# Altium schematic sheet PAM_Interface.SchDoc
size A3; SheetNumber: 1; SheetTotal: 1
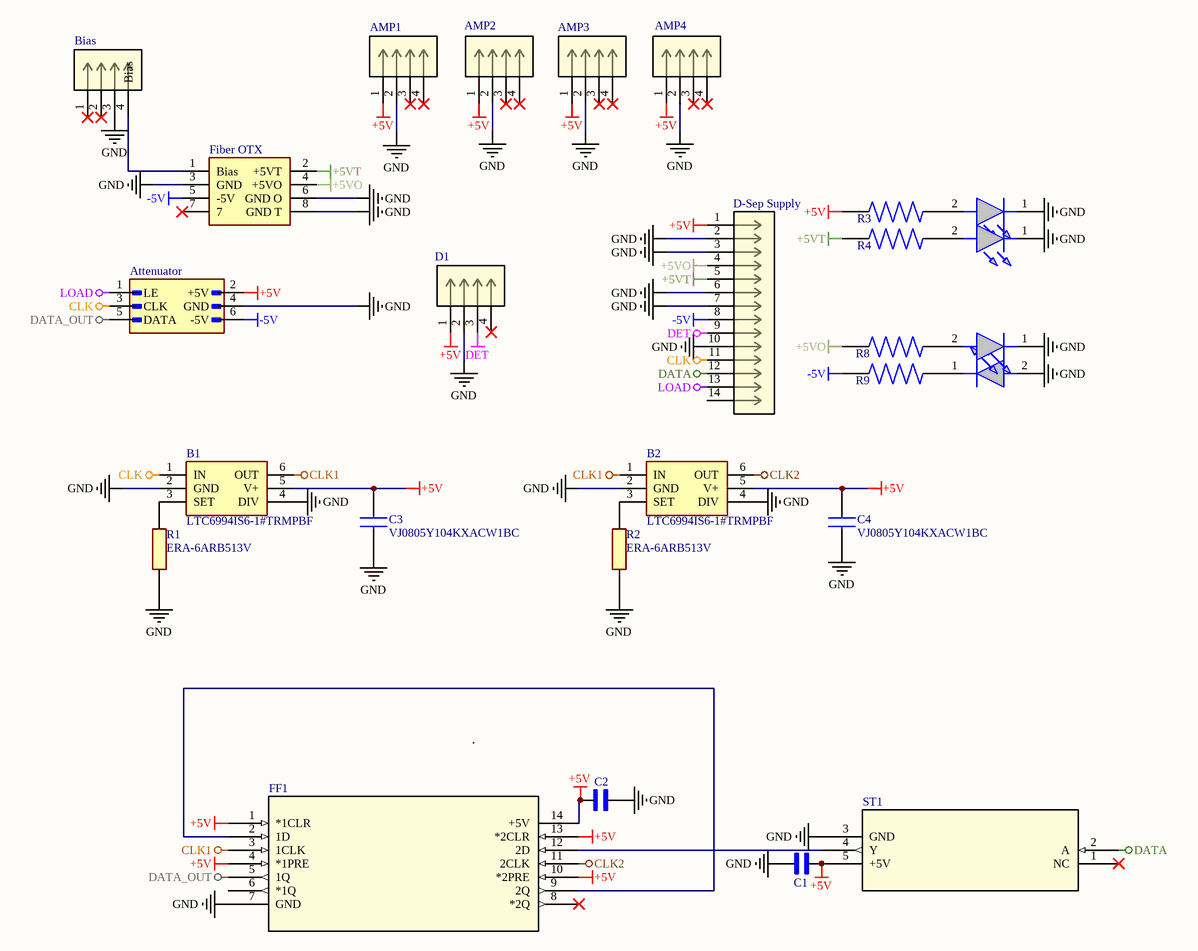
[diagram p0: PAM_Interface.SchDoc]

## Parts
+5VO  SML-LX1206GW-TR  [LEDC3216X110N]  (value not drawn)
+5VT  SML-LX1206GW-TR  [LEDC3216X110N]  (value not drawn)
-5V  SML-LX1206GW-TR  [LEDC3216X110N]  (value not drawn)
AMP1  DF11-4DP-2DSA(24)  [CON4_2X2_UF_DF11_HIR]  (value not drawn)
AMP2  DF11-4DP-2DSA(24)  [CON4_2X2_UF_DF11_HIR]  (value not drawn)
AMP3  DF11-4DP-2DSA(24)  [CON4_2X2_UF_DF11_HIR]  (value not drawn)
AMP4  DF11-4DP-2DSA(24)  [CON4_2X2_UF_DF11_HIR]  (value not drawn)
Attenuator  DF11-6DP-2DSA(24)  [HIROSE_DF11-6DP-2DSA(24)]  (value not drawn)
B1  LTC6994IS6-1#TRMPBF  [SOT95P280X100-6N]
B2  LTC6994IS6-1#TRMPBF  [SOT95P280X100-6N]
Bias  DF11-4DP-2DSA(24)  [CON4_2X2_UF_DF11_HIR]  (value not drawn)
C1  VJ0805Y104KXQCW1BC  [CAPC2012X145N]  (value not drawn)
C2  VJ0805Y104KXQCW1BC  [CAPC2012X145N]  (value not drawn)
C3  VJ0805Y104KXACW1BC  [CAPC2012X70N]
C4  VJ0805Y104KXACW1BC  [CAPC2012X70N]
D1  DF11-4DP-2DSA(24)  [CON4_2X2_UF_DF11_HIR]  (value not drawn)
D-Sep_Supply  DF11-14DP-2DSA(24)  [CON14_2X7_UF_DF11_HIR]  (value not drawn)
FF1  SN74ACT74PWRQ1  [PW14]  (value not drawn)
Fiber_OTX  DF11-8DP-2DSA(24)  [HIROSE_DF11-8DP-2DSA(24)]  (value not drawn)
LED1  SML-LX1206GW-TR  [LEDC3216X110N]  (value not drawn)
R1  ERA-6ARB513V  [ERA6AEB101V]
R2  ERA-6ARB513V  [ERA6AEB101V]
R3  ERA6VEB1000V  [RES_ERA6VEB1000V]  (value not drawn)
R4  ERA6VEB1000V  [RES_ERA6VEB1000V]  (value not drawn)
R8  ERA6VEB1000V  [RES_ERA6VEB1000V]  (value not drawn)
R9  ERA6VEB1000V  [RES_ERA6VEB1000V]  (value not drawn)
ST1  SN74LVC1G17DBVR  [DBV5]  (value not drawn)

## Nets
+5V: AMP1.1(+5V) AMP2.1(+5V) AMP3.1(+5V) AMP4.1(+5V) Attenuator.2(+5V) B1.5(V+) B2.5(V+) C1.2 C2.1 C3.2 C4.2 D1.1(+5V) D-Sep_Supply.1(+5V) FF1.1(*1CLR) FF1.4(*1PRE) FF1.10(*2PRE) FF1.13(*2CLR) FF1.14(+5V) R3.1 ST1.5(+5V)
+5VO: D-Sep_Supply.4(GND) Fiber_OTX.4(+5VO) R8.1
+5VT: D-Sep_Supply.5(DET) Fiber_OTX.2(+5VT) R4.2
-5V: Attenuator.6(-5V) D-Sep_Supply.8(NC) Fiber_OTX.5(-5V) R9.1
CLK: Attenuator.3(CLK) B1.1(IN) D-Sep_Supply.11(GND)
CLK1: B1.6(OUT) B2.1(IN) FF1.3(1CLK)
CLK2: B2.6(OUT) FF1.11(2CLK)
DATA: D-Sep_Supply.12(-5V) ST1.2(A)
DATA_OUT: Attenuator.5(DATA) FF1.5(1Q)
DET: D1.3(DET) D-Sep_Supply.9(GND)
GND: +5VO.1(K) +5VT.1(K) -5V.2(A) AMP1.2(GND) AMP2.2(GND) AMP3.2(GND) AMP4.2(GND) Attenuator.4(GND) B1.2(GND) B1.4(DIV) B2.2(GND) B2.4(DIV) Bias.3(GND) C1.1 C2.2 D1.2(GND) D-Sep_Supply.2(GND) D-Sep_Supply.3(+5V_TEC) D-Sep_Supply.6(CLK) D-Sep_Supply.7(LOAD) D-Sep_Supply.10(+5V_OTX) FF1.7(GND) Fiber_OTX.3(GND) Fiber_OTX.6(GND_O) Fiber_OTX.8(GND_T) LED1.1(K) R1.2 R2.2 ST1.3(GND)
LOAD: Attenuator.1(LE) D-Sep_Supply.13(GND)
Net+5VO_2: +5VO.2(A) R8.2
Net+5VT_2: +5VT.2(A) R4.1
Net-5V_1: -5V.1(K) R9.2
NetB1_3: B1.3(SET) R1.1
NetB2_3: B2.3(SET) R2.1
NetBias_4: Bias.4(Bias) Fiber_OTX.1(Bias)
NetFF1_2: FF1.2(1D) FF1.9(2Q)
NetFF1_12: FF1.12(2D) ST1.4(Y)
NetLED1_2: LED1.2(A) R3.2

Not connected (* = marked no-connect by the designer): AMP1 3* 4*; AMP2 3* 4*; AMP3 3* 4*; AMP4 3* 4*; Bias 1* 2*; C3 1; C4 1; D1 4*; D-Sep_Supply 14(DATA); FF1 6(*1Q) 8(*2Q)*; Fiber_OTX 7*; ST1 1(NC)*

## Notes on the sheet
- Labels drawn without touching a wire or pin: GND

## Library data of the parts
+5VO +5VT -5V LED1 = SML-LX1206GW-TR: LUMEX - SML-LX1206GW-TR - LED, 2MM X 1.6MM, GREEN, 10MCD, 565NM; Geometry.Height: 1.1mm; Manufacturer_Name: Lumex; Manufacturer_Part_Number: SML-LX1206GW-TR; Mouser Part Number: 696-SML-LX1206GW; Mouser Price/Stock: https://www.mouser.co.uk/ProductDetail/Lumex/SML-LX1206GW-TR?qs=k7wqd3tv8MigBobUZMRxZw%3D%3D; Arrow Part Number: SML-LX1206GW-TR; Arrow Price/Stock: https://www.arrow.com/en/products/sml-lx1206gw-tr/lumex?region=nac; Datasheet Link: https://datasheet.datasheetarchive.com/originals/distributors/Datasheets-315/519820.pdf
AMP1-AMP4 Bias D1 = DF11-4DP-2DSA24: No Description Available; Manufacturer_Name: Hirose; Copyright: Copyright (C) 2025 Ultra Librarian. All rights reserved.; Manufacturer_Part_Number: DF11-4DP-2DSA(24); RefDes: RefDes; Type: Type
Attenuator = DF11-6DP-2DSA(24): Connector Header Through Hole 6 position 0.079 (2.00mm); MF: Hirose Electric Co Ltd; SnapEDA_Link: https://www.snapeda.com/parts/DF11-6DP-2DSA(24)/Hirose+Electric+Co+Ltd/view-part/?ref=snap; Package: None; Value: *; MP: DF11-6DP-2DSA(24); Check_prices: https://www.snapeda.com/parts/DF11-6DP-2DSA(24)/Hirose+Electric+Co+Ltd/view-part/?ref=eda
B1 B2 = LTC6994IS6-1#TRMPBF: Timer, 2.25 ??5.5 V, 6-pin TSOT-23%0%0; Manufacturer_Name: Analog Devices; Geometry.Height: 1mm; Mouser Part Number: 584-C6994IS6-1TRMPBF; Mouser Price/Stock: https://www.mouser.co.uk/ProductDetail/Analog-Devices/LTC6994IS6-1TRMPBF?qs=hVkxg5c3xu854p16aptbEw%3D%3D; Manufacturer_Part_Number: LTC6994IS6-1#TRMPBF; Datasheet Link: http://cds.linear.com/docs/en/datasheet/699412fb.pdf
C1 = VJ0805Y104KXQCW1BC: Value: 0.1 uF; MF: {'manufacturer': u'Vishay Vitramon'}; Package: None; Price: None; MP: VJ0805Y104KXQCW1BC; Availability: Unavailable
C2 = VJ0805Y104KXQCW1BC: MF: {'manufacturer': u'Vishay Vitramon'}; Value: 0.1 uF; Package: None; Price: None; MP: VJ0805Y104KXQCW1BC; Availability: Unavailable
C3 C4 = VJ0805Y104KXACW1BC: VISHAY - VJ0805Y104KXACW1BC - CAP, MLCC, X7R, 0.1UF, 50V, 0805; Geometry.Height: 0.7mm; Mouser Part Number: 71-VJ0805Y104KXACWBC; Mouser Price/Stock: https://www.mouser.co.uk/ProductDetail/Vishay-Vitramon/VJ0805Y104KXACW1BC?qs=%252BI21JsQ7UT26DJQ7U%2F1R%2Fw%3D%3D; Manufacturer_Name: Vishay; Manufacturer_Part_Number: VJ0805Y104KXACW1BC; Datasheet Link: *
D-Sep_Supply = DF11-14DP-2DSA24: No Description Available; Manufacturer_Name: Hirose; Copyright: Copyright (C) 2025 Ultra Librarian. All rights reserved.; Manufacturer_Part_Number: DF11-14DP-2DSA(24); RefDes: RefDes; Type: Type
FF1 = SN74ACT74PWR: Dual Positive-Edge-Triggered D-Type Flip-Flops With Clear and Preset 14-TSSOP -40 to 125; Manufacturer_Name: Texas Instruments; Copyright: Copyright (C) 2025 Ultra Librarian. All rights reserved.; Manufacturer_Part_Number: SN74ACT74PWR; Datasheet: https://www.ti.com/lit/gpn/sn74act74; RefDes: RefDes; Type: Type
Fiber_OTX = DF11-8DP-2DSA(24): Connector Header Through Hole 8 position 0.079 (2.00mm); MF: Hirose Electric; SnapEDA_Link: https://www.snapeda.com/parts/DF11-8DP-2DSA(24)/Hirose/view-part/?ref=snap; Package: None; Value: *; MP: DF11-8DP-2DSA(24); Check_prices: https://www.snapeda.com/parts/DF11-8DP-2DSA(24)/Hirose/view-part/?ref=eda
R1 R2 = ERA-6ARB513V: Metal Thin Film Chip Resistor, 0805, 0.125W; Manufacturer_Name: Panasonic; Geometry.Height: 0.6mm; Mouser Part Number: *; Mouser Price/Stock: *; Manufacturer_Part_Number: ERA-6ARB513V; Datasheet Link: https://industrial.panasonic.com/cdbs/www-data/pdf/RDM0000/AOA0000C307.pdf
ST1 = SN74LVC1G17DBVR: Single 1.65-V to 5.5-V buffer with Schmitt-Trigger inputs 5-SOT-23 -40 to 125; Manufacturer_Name: Texas Instruments; Copyright: Copyright (C) 2025 Ultra Librarian. All rights reserved.; Manufacturer_Part_Number: SN74LVC1G17DBVR; RefDes: RefDes; Type: Type
R3 R4 R8 R9 = ERA6VEB1000V: Package: None; Value: *; MP: ERA6VEB1000V; Availability: Unavailable; Price: None